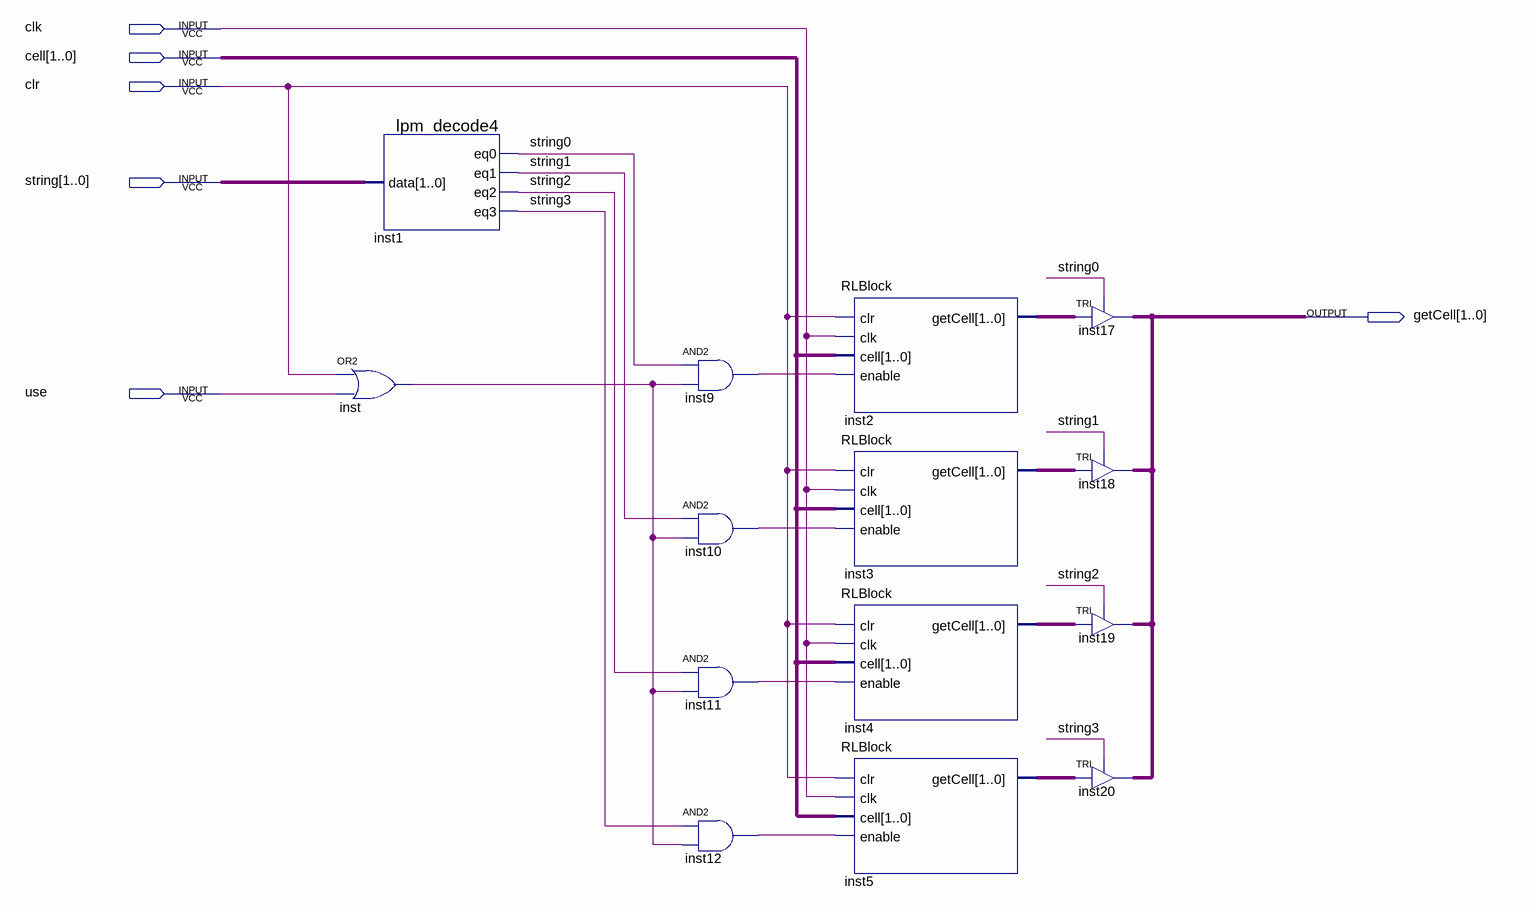
[diagram p0: schematic sheet]
// Quartus schematic ReplaceLogic.bdf as structural Verilog: 14 symbols, 6 pins
module ReplaceLogic (
  input  clk,
  input  [1:0] \cell ,
  input  clr,
  input  [1:0] \string ,
  input  \use ,
  output [1:0] getCell
);

  wire inst9_out, inst10_out, inst11_out, inst12_out, inst_out, string2, string3;
  wire [1:0] inst2_getcell, inst3_getcell, inst4_getcell, inst5_getcell;

  or inst (inst_out, clr, \use );
  lpm_decode4 inst1 (.data(\string ), .eq0(\string [0]), .eq1(\string [1]), .eq2(string2), .eq3(string3));
  and inst9 (inst9_out, \string [0], inst_out);
  and inst10 (inst10_out, \string [1], inst_out);
  and inst11 (inst11_out, string2, inst_out);
  and inst12 (inst12_out, string3, inst_out);
  RLBlock inst2 (.clr(clr), .clk(clk), .\cell (\cell ), .enable(inst9_out), .getCell(inst2_getcell));
  RLBlock inst3 (.clr(clr), .clk(clk), .\cell (\cell ), .enable(inst10_out), .getCell(inst3_getcell));
  RLBlock inst4 (.clr(clr), .clk(clk), .\cell (\cell ), .enable(inst11_out), .getCell(inst4_getcell));
  RLBlock inst5 (.clr(clr), .clk(clk), .\cell (\cell ), .enable(inst12_out), .getCell(inst5_getcell));
  TRI inst17[1:0] (.IN(inst2_getcell), .OE(\string [0]), .OUT(getCell));
  TRI inst18[1:0] (.IN(inst3_getcell), .OE(\string [1]), .OUT(getCell));
  TRI inst19[1:0] (.IN(inst4_getcell), .OE(string2), .OUT(getCell));
  TRI inst20[1:0] (.IN(inst5_getcell), .OE(string3), .OUT(getCell));
endmodule
